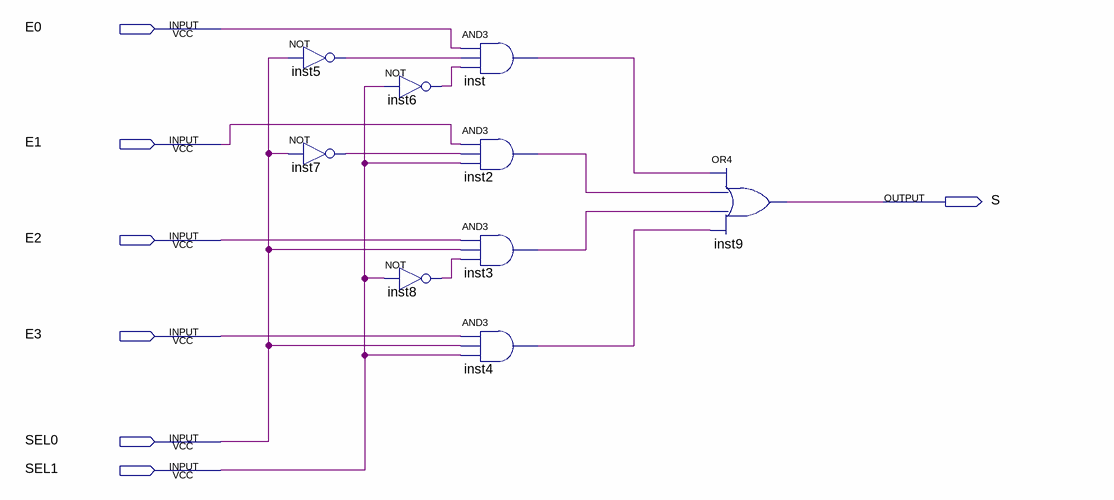
[diagram p0: schematic sheet]
// Quartus schematic mutiplex.bdf as structural Verilog: 9 symbols, 7 pins
module mutiplex (
  input  E0,
  input  E1,
  input  E2,
  input  E3,
  input  SEL0,
  input  SEL1,
  output S
);

  wire inst2_out, inst3_out, inst4_out, inst5_out, inst6_out, inst7_out, inst8_out, inst_out;

  not inst5 (inst5_out, SEL0);
  not inst7 (inst7_out, SEL0);
  not inst6 (inst6_out, SEL1);
  not inst8 (inst8_out, SEL1);
  and inst (inst_out, E0, inst5_out, inst6_out);
  and inst2 (inst2_out, E1, inst7_out, SEL1);
  and inst3 (inst3_out, E2, SEL0, inst8_out);
  and inst4 (inst4_out, E3, SEL0, SEL1);
  or inst9 (S, inst_out, inst2_out, inst3_out, inst4_out);
endmodule
